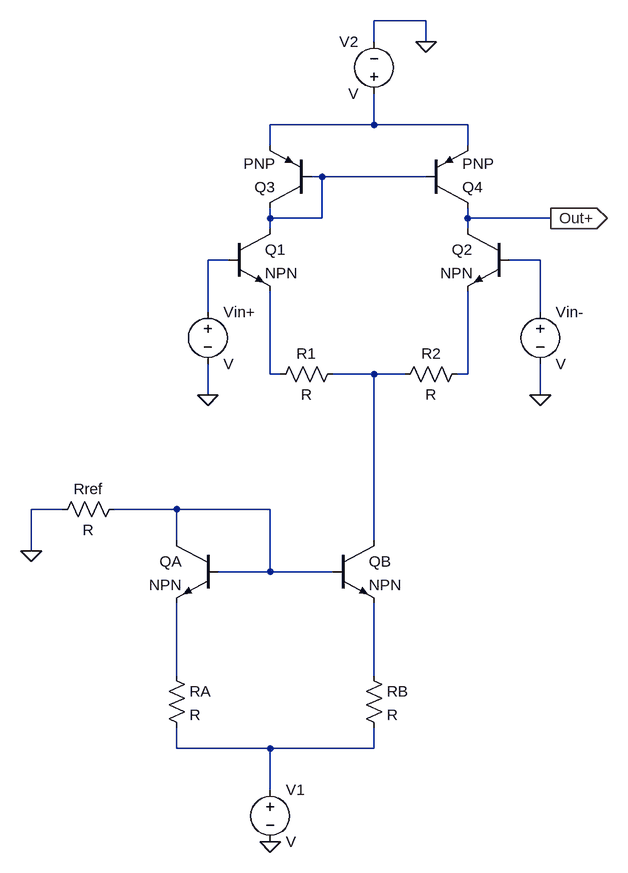
[diagram p0: schematic BJT_Diff_amp_activeLoad.asc]
BJT_Diff_amp_activeLoad.asc, the LTspice schematic file:
Version 4
SHEET 1 948 1044
WIRE 240 -240 160 -240
WIRE 160 -208 160 -240
WIRE 240 -208 240 -240
WIRE 160 -80 160 -128
WIRE 160 -80 0 -80
WIRE 304 -80 160 -80
WIRE 0 -48 0 -80
WIRE 304 -48 304 -80
WIRE 80 0 64 0
WIRE 240 0 80 0
WIRE 0 64 0 48
WIRE 80 64 80 0
WIRE 80 64 0 64
WIRE 304 64 304 48
WIRE 432 64 304 64
WIRE 0 80 0 64
WIRE 304 80 304 64
WIRE -64 128 -96 128
WIRE 416 128 368 128
WIRE -96 208 -96 128
WIRE 416 208 416 128
WIRE 0 304 0 176
WIRE 16 304 0 304
WIRE 160 304 96 304
WIRE 208 304 160 304
WIRE 304 304 304 176
WIRE 304 304 288 304
WIRE -96 336 -96 288
WIRE 416 336 416 288
WIRE -320 512 -368 512
WIRE -144 512 -240 512
WIRE 0 512 -144 512
WIRE -144 560 -144 512
WIRE 160 560 160 304
WIRE -368 576 -368 512
WIRE 0 608 0 512
WIRE 0 608 -80 608
WIRE 96 608 0 608
WIRE -144 768 -144 656
WIRE 160 768 160 656
WIRE -144 880 -144 848
WIRE 0 880 -144 880
WIRE 160 880 160 848
WIRE 160 880 0 880
WIRE 0 944 0 880
FLAG -96 336 0
FLAG 416 336 0
FLAG -368 576 0
FLAG 0 1024 0
FLAG 240 -208 0
FLAG 432 64 Out+
IOPIN 432 64 Out
SYMBOL npn 368 80 M0
SYMATTR InstName Q2
SYMBOL npn -64 80 R0
SYMATTR InstName Q1
SYMBOL res 112 288 R90
WINDOW 0 0 56 VBottom 2
WINDOW 3 32 56 VTop 2
SYMATTR InstName R1
SYMBOL res 304 288 R90
WINDOW 0 0 56 VBottom 2
WINDOW 3 32 56 VTop 2
SYMATTR InstName R2
SYMBOL npn 96 560 R0
SYMATTR InstName QB
SYMBOL npn -80 560 M0
SYMATTR InstName QA
SYMBOL res -160 752 R0
SYMATTR InstName RA
SYMBOL res 144 752 R0
SYMATTR InstName RB
SYMBOL res -224 496 R90
WINDOW 0 0 56 VBottom 2
WINDOW 3 32 56 VTop 2
SYMATTR InstName Rref
SYMBOL voltage 0 928 R0
SYMATTR InstName V1
SYMBOL voltage 160 -112 R180
WINDOW 0 24 96 Left 2
WINDOW 3 24 16 Left 2
SYMATTR InstName V2
SYMBOL voltage -96 192 R0
SYMATTR InstName Vin+
SYMBOL voltage 416 192 R0
SYMATTR InstName Vin-
SYMBOL pnp 64 48 R180
SYMATTR InstName Q3
SYMBOL pnp 240 48 M180
SYMATTR InstName Q4

The netlist it stands for:
* BJT_Diff_amp_activeLoad.asc
Q2 Out+ N004 N007 0 NPN
Q1 N002 N003 N005 0 NPN
R1 N006 N005 R
R2 N007 N006 R
QB N006 N008 N010 0 NPN
QA N008 N008 N009 0 NPN
RA N009 N011 R
RB N010 N011 R
Rref N008 0 R
V1 N011 0 V
V2 N001 0 V
Vin+ N003 0 V
Vin- N004 0 V
Q3 N002 N002 N001 0 PNP
Q4 Out+ N002 N001 0 PNP
.model NPN NPN
.model PNP PNP
.lib standard.bjt
.backanno
.end